# Altium schematic sheet drive.SchDoc
size A3
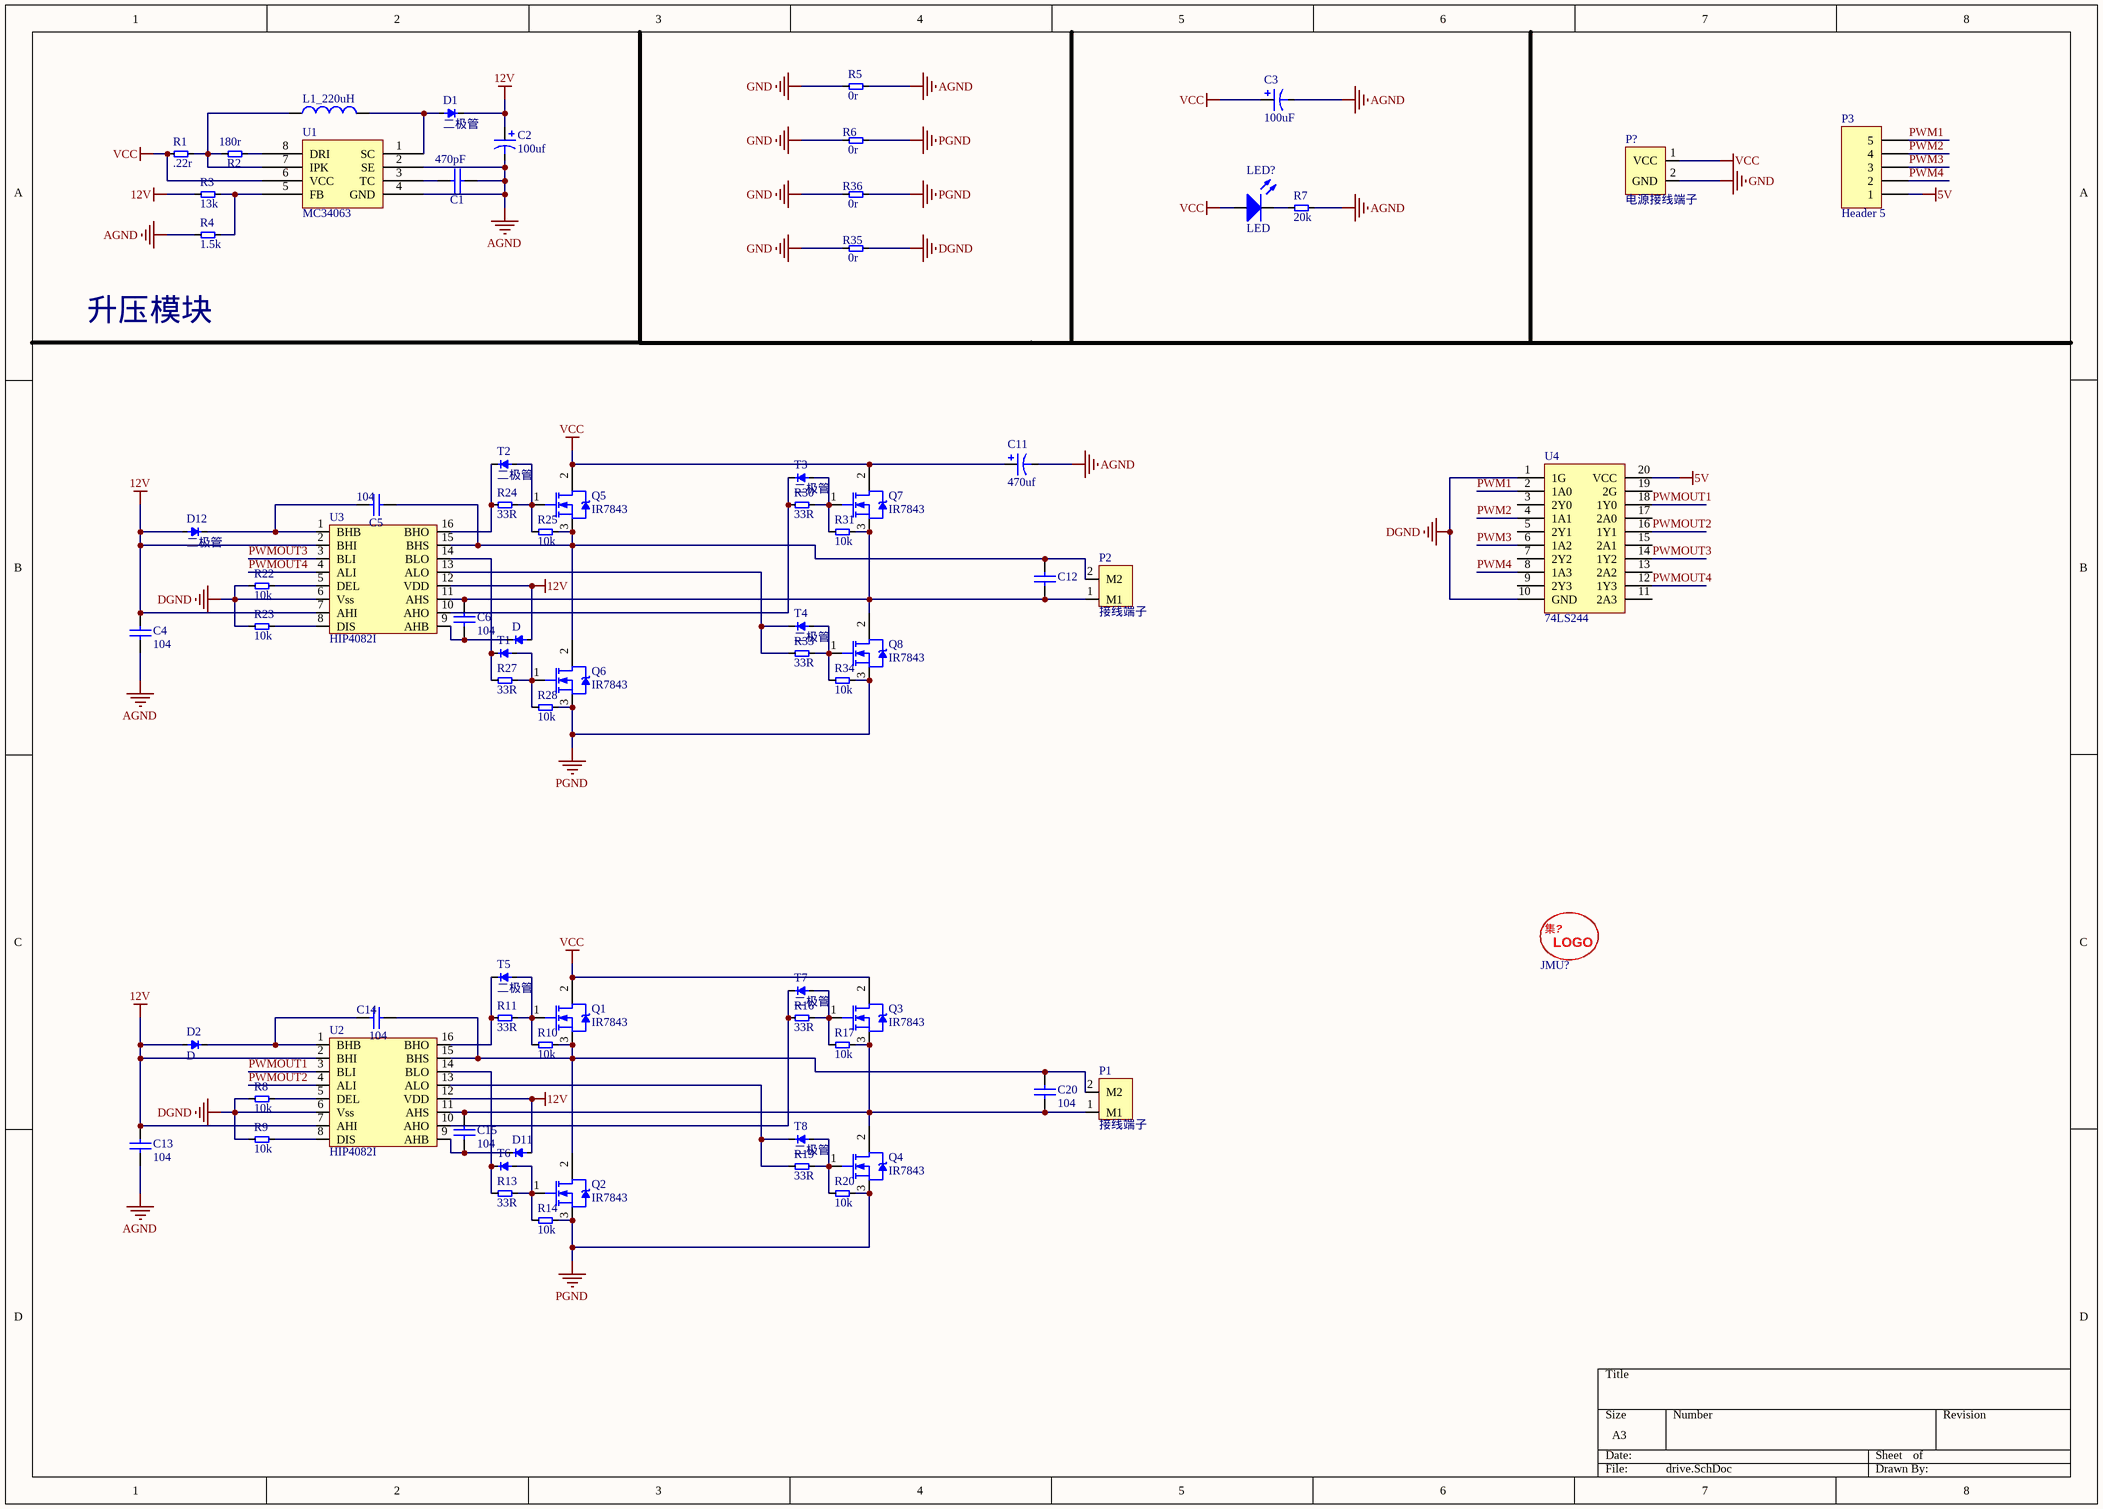
[diagram p0: drive.SchDoc]

## Parts
C1  470pF  [0805]
C2  100uf  [ED6.3]
C3  value 100uF  [pol cap(10uF)]  (hidden comment: pol cap)
C4  104  [0805]
C5  104  [0805]
C6  104  [0805]
C11  470uf  [ED8]
C12  104  [0805]  (value not drawn)
C13  104  [0805]
C14  104  [0805]
C15  104  [0805]
C20  104  [0805]
D  二极管  [二极管]  (value not drawn)
D1  二极管  [二极管]
D2  D  [二极管]
D11  二极管  [二极管]  (value not drawn)
D12  二极管  [二极管]
JMU?  LOGO(JMU)  [JMU_logo（1）]  (value not drawn)
L1_220uH  Inductor  [电感8*8]  (value not drawn)
LED?  LED  [LED(0805)]
P1  接线端子  [接线端子]
P2  接线端子  [接线端子]
P3  Header 5  [HDR1X5]
P?  电源接线端子  [接线端子]
Q1  IR7843  [TO-252  mos管]
Q2  IR7843  [TO-252  mos管]
Q3  IR7843  [TO-252  mos管]
Q4  IR7843  [TO-252  mos管]
Q5  IR7843  [TO-252  mos管]
Q6  IR7843  [TO-252  mos管]
Q7  IR7843  [TO-252  mos管]
Q8  IR7843  [TO-252  mos管]
R1  .22r  [0805]
R2  180r  [0805]
R3  13k  [0805]
R4  1.5k  [0805]
R5  0r  [0805]
R6  0r  [0805]
R7  20k  [0603]
R8  10k  [0603]
R9  10k  [0603]
R10  10k  [0603]
R11  33R  [0603]
R13  33R  [0603]
R14  10k  [0603]
R16  33R  [0603]
R17  10k  [0603]
R19  33R  [0603]
R20  10k  [0603]
R22  10k  [0603]
R23  10k  [0603]
R24  33R  [0603]
R25  10k  [0603]
R27  33R  [0603]
R28  10k  [0603]
R30  33R  [0603]
R31  10k  [0603]
R33  33R  [0603]
R34  10k  [0603]
R35  0r  [0805]
R36  0r  [0805]
T1  二极管  [LED(0805)]  (value not drawn)
T2  二极管  [LED(0805)]
T3  二极管  [LED(0805)]
T4  二极管  [LED(0805)]
T5  二极管  [LED(0805)]
T6  二极管  [LED(0805)]  (value not drawn)
T7  二极管  [LED(0805)]
T8  二极管  [LED(0805)]
U1  MC34063  [SO8NB]
U2  HIP4082I  [HIP4082I]
U3  HIP4082I  [HIP4082I]
U4  74LS244  [74LS244D]

## Nets
5V: P3.1 U4.20(VCC)
12V: C2.1 C4.2 C13.2 D.1(+) D1.2(-) D2.1(+) D11.1(+) D12.1(+) R3.1 U2.2(BHI) U2.7(AHI) U2.12(VDD) U3.2(BHI) U3.7(AHI) U3.12(VDD)
AGND: C1.2 C2.2 C3.2 C4.1 C11.2 C13.1 R4.1 R5.2 R7.2 U1.2(SE) U1.4(GND)
DGND: R8.1 R9.1 R22.1 R23.1 R35.2 U2.6(Vss) U3.6(Vss) U4.1(1G) U4.10(GND)
GND: P?.2(GND) R5.1 R6.1 R35.1 R36.1
PGND: Q2.3(S) Q4.3(S) Q6.3(S) Q8.3(S) R6.2 R14.2 R20.2 R28.2 R34.2 R36.2
VCC: C3.1 C11.1 LED?.1(A) P?.1(VCC) Q1.2(D) Q3.2(D) Q5.2(D) Q7.2(D) R1.1 U1.6(VCC)
PWM1: P3.5 U4.2(1A0)
PWM2: P3.4 U4.4(1A1)
PWM3: P3.3 U4.6(1A2)
PWM4: P3.2 U4.8(1A3)
PWMOUT1: U2.3(BLI) U4.18(1Y0)
PWMOUT2: U2.4(ALI) U4.16(1Y1)
PWMOUT3: U3.3(BLI) U4.14(1Y2)
PWMOUT4: U3.4(ALI) U4.12(1Y3)
NetC1_1: C1.1 U1.3(TC)
NetC5_1: C5.1 D12.2(-) U3.1(BHB)
NetC5_2: C5.2 C12.2 P2.2(M2) Q5.3(S) Q6.2(D) R25.2 U3.15(BHS)
NetC6_1: C6.1 D.2(-) U3.9(AHB)
NetC6_2: C6.2 C12.1 P2.1(M1) Q7.3(S) Q8.2(D) R31.2 U3.11(AHS)
NetC14_1: C14.1 D2.2(-) U2.1(BHB)
NetC14_2: C14.2 C20.2 P1.2(M2) Q1.3(S) Q2.2(D) R10.2 U2.15(BHS)
NetC15_1: C15.1 D11.2(-) U2.9(AHB)
NetC15_2: C15.2 C20.1 P1.1(M1) Q3.3(S) Q4.2(D) R17.2 U2.11(AHS)
NetD1_1: D1.1(+) L1_220uH.2 U1.1(SC)
NetL1_220uH_1: L1_220uH.1 R1.2 R2.1 U1.7(IPK)
NetLED?_2: LED?.2(K) R7.1
NetQ1_1: Q1.1(G) R10.1 R11.2 T5.1(+)
NetQ2_1: Q2.1(G) R13.2 R14.1 T6.1(+)
NetQ3_1: Q3.1(G) R16.2 R17.1 T7.1(+)
NetQ4_1: Q4.1(G) R19.2 R20.1 T8.1(+)
NetQ5_1: Q5.1(G) R24.2 R25.1 T2.1(+)
NetQ6_1: Q6.1(G) R27.2 R28.1 T1.1(+)
NetQ7_1: Q7.1(G) R30.2 R31.1 T3.1(+)
NetQ8_1: Q8.1(G) R33.2 R34.1 T4.1(+)
NetR2_2: R2.2 U1.8(DRI)
NetR3_2: R3.2 R4.2 U1.5(FB)
NetR8_2: R8.2 U2.5(DEL)
NetR9_2: R9.2 U2.8(DIS)
NetR11_1: R11.1 T5.2(-) U2.16(BHO)
NetR13_1: R13.1 T6.2(-) U2.14(BLO)
NetR16_1: R16.1 T7.2(-) U2.10(AHO)
NetR19_1: R19.1 T8.2(-) U2.13(ALO)
NetR22_2: R22.2 U3.5(DEL)
NetR23_2: R23.2 U3.8(DIS)
NetR24_1: R24.1 T2.2(-) U3.16(BHO)
NetR27_1: R27.1 T1.2(-) U3.14(BLO)
NetR30_1: R30.1 T3.2(-) U3.10(AHO)
NetR33_1: R33.1 T4.2(-) U3.13(ALO)

Not connected (* = marked no-connect by the designer): U4 3(2Y0) 5(2Y1) 7(2Y2) 9(2Y3) 11(2A3) 13(2A2) 15(2A1) 17(2A0) 19(2G)

## Notes on the sheet
- 升压模块
- (in symbol JMU-LOGO) 集?; LOGO

## Library data of the parts
C1 = Cap: Capacitor
C2 C11 = 固态贴片电容: ED8:470UF  ED6.3:100UF
C3 = pol cap: 通用有极电容
C4-C6 C12-C15 C20 = Cap: 无极电容; Value: 10uF
D2 = 二极管
JMU? = JMU-LOGO
L1_220uH = Inductor: Code_IEC: 1005; Value: 220uH; Published: 8-Jun-2000; LatestRevisionDate: 29-May-2009; LatestRevisionNote: IPC-7351 Footprint Added.; PackageReference: 0402-A; Publisher: Altium Limited; PackageDescription: Chip Inductor; Code_JEITA: 0402
LED? = LED: 发光二极管
P3 = Header 5: Header, 5-Pin; LatestRevisionDate: 17-Jul-2002; LatestRevisionNote: Re-released for DXP Platform.; Publisher: Altium Limited
P? = 电源接线端子: 电源线
Q1-Q8 = NMOS-2: N-Channel Power MOSFET; Note: Pin 2 is electrically connected to pin 4.; Published: 8-Jun-2000; LatestRevisionDate: 17-Jul-2002; LatestRevisionNote: Re-released for DXP Platform.; DatasheetVersion: PD-9.814; PackageVersion: Feb-1997; PackageReference: TO-220AB; Publisher: Altium Limited; PackageDescription: TO, Thru-Hole, Vertical, Heatsink Mounted; 3 In-Line Leads; Pitch 2.54 mm; ComponentLink1Description: Manufacturer Link; ComponentLink1URL: http://www.irf.com/
R1-R11 R13 R14 R16 R17 R19 R20 R22-R25 R27 R28 R30 R31 R33-R36 = R